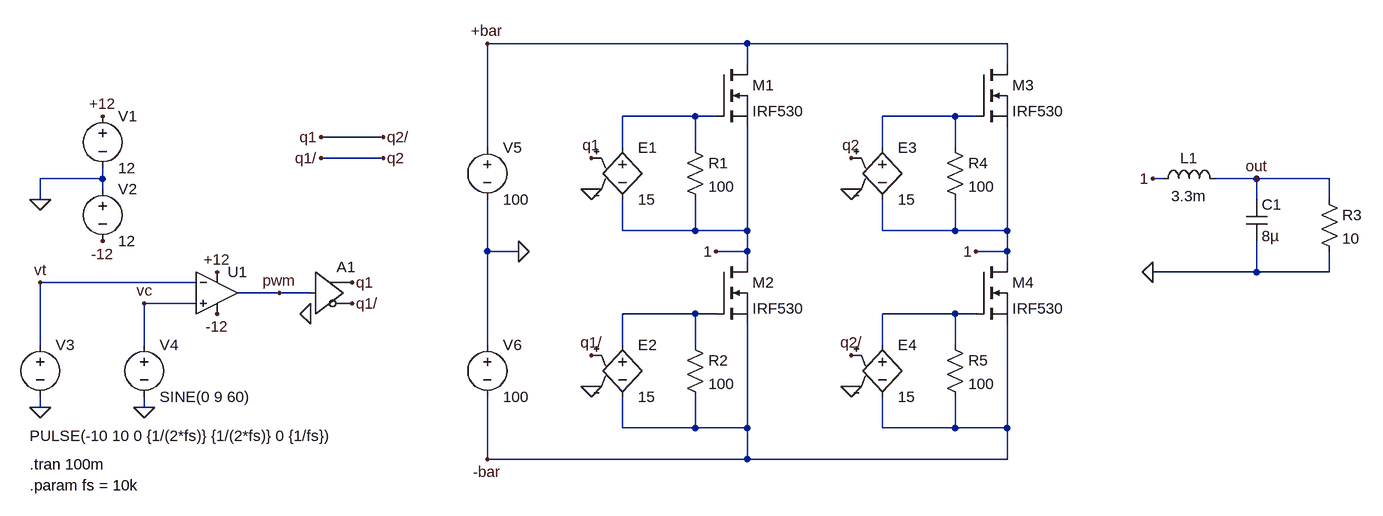
[diagram p0: schematic EXP07_1.asc]
EXP07_1.asc, the LTspice schematic file:
Version 4
SHEET 1 2024 680
WIRE 1072 -112 672 -112
WIRE 1472 -112 1072 -112
WIRE 1072 -80 1072 -112
WIRE 1472 -80 1472 -112
WIRE 992 0 880 0
WIRE 1024 0 992 0
WIRE 1392 0 1280 0
WIRE 1424 0 1392 0
WIRE 512 32 416 32
WIRE 672 48 672 -112
WIRE 880 48 880 0
WIRE 992 48 992 0
WIRE 1280 48 1280 0
WIRE 1392 48 1392 0
WIRE 512 64 416 64
WIRE 80 96 80 80
WIRE 80 96 -16 96
WIRE 1712 96 1696 96
WIRE 1856 96 1792 96
WIRE 1968 96 1856 96
WIRE 80 112 80 96
WIRE -16 128 -16 96
WIRE 1856 128 1856 96
WIRE 1968 128 1968 96
WIRE 880 176 880 128
WIRE 992 176 992 128
WIRE 992 176 880 176
WIRE 1072 176 1072 16
WIRE 1072 176 992 176
WIRE 1280 176 1280 128
WIRE 1392 176 1392 128
WIRE 1392 176 1280 176
WIRE 1472 176 1472 16
WIRE 1472 176 1392 176
WIRE 672 208 672 128
WIRE 720 208 672 208
WIRE 1072 208 1072 176
WIRE 1072 208 1024 208
WIRE 1472 208 1472 176
WIRE 1472 208 1424 208
WIRE 1072 224 1072 208
WIRE 1472 224 1472 208
WIRE 1856 240 1856 192
WIRE 1856 240 1696 240
WIRE 1968 240 1968 208
WIRE 1968 240 1856 240
WIRE 224 256 -16 256
WIRE 352 272 288 272
WIRE 400 272 352 272
WIRE 224 288 144 288
WIRE 992 304 880 304
WIRE 1024 304 992 304
WIRE 1392 304 1280 304
WIRE 1424 304 1392 304
WIRE -16 352 -16 256
WIRE 144 352 144 288
WIRE 672 352 672 208
WIRE 880 352 880 304
WIRE 992 352 992 304
WIRE 1280 352 1280 304
WIRE 1392 352 1392 304
WIRE -16 448 -16 432
WIRE 144 448 144 432
WIRE 880 480 880 432
WIRE 992 480 992 432
WIRE 992 480 880 480
WIRE 1072 480 1072 320
WIRE 1072 480 992 480
WIRE 1280 480 1280 432
WIRE 1392 480 1392 432
WIRE 1392 480 1280 480
WIRE 1472 480 1472 320
WIRE 1472 480 1392 480
WIRE 672 528 672 432
WIRE 1072 528 1072 480
WIRE 1072 528 672 528
WIRE 1472 528 1472 480
WIRE 1472 528 1072 528
FLAG -16 128 0
FLAG -16 448 0
FLAG 144 448 0
FLAG 400 304 0
FLAG 80 0 +12
FLAG 256 240 +12
FLAG 80 192 -12
FLAG 256 304 -12
FLAG 464 256 q1
FLAG 464 288 q1/
FLAG -16 256 vt
FLAG 144 288 vc
FLAG 832 112 0
FLAG 832 416 0
FLAG 1696 240 0
FLAG 720 208 0
FLAG 832 64 q1
FLAG 832 368 q1/
FLAG 1696 96 1
FLAG 1024 208 1
FLAG 672 -112 +bar
FLAG 672 528 -bar
FLAG 1856 96 out
FLAG 352 272 pwm
FLAG 416 32 q1
FLAG 512 32 q2/
FLAG 416 64 q1/
FLAG 512 64 q2
FLAG 1232 112 0
FLAG 1232 416 0
FLAG 1424 208 1
FLAG 1232 64 q2
FLAG 1232 368 q2/
SYMBOL voltage 80 -16 R0
WINDOW 123 0 0 Left 0
WINDOW 39 0 0 Left 0
SYMATTR InstName V1
SYMATTR Value 12
SYMBOL voltage 80 96 R0
WINDOW 123 0 0 Left 0
WINDOW 39 0 0 Left 0
SYMATTR InstName V2
SYMATTR Value 12
SYMBOL voltage -16 336 R0
WINDOW 3 -16 156 Left 2
WINDOW 123 0 0 Left 0
WINDOW 39 0 0 Left 0
SYMATTR InstName V3
SYMATTR Value PULSE(-10 10 0 {1/(2*fs)} {1/(2*fs)} 0 {1/fs})
SYMBOL voltage 144 336 R0
WINDOW 123 0 0 Left 0
WINDOW 39 0 0 Left 0
SYMATTR InstName V4
SYMATTR Value SINE(0 9 60)
SYMBOL voltage 672 32 R0
WINDOW 123 0 0 Left 0
WINDOW 39 0 0 Left 0
SYMATTR InstName V5
SYMATTR Value 100
SYMBOL OpAmps\\UniversalOpAmp2 256 272 R0
SYMATTR InstName U1
SYMBOL Digital\\buf 400 208 R0
SYMATTR InstName A1
SYMBOL e 880 32 R0
SYMATTR InstName E1
SYMATTR Value 15
SYMBOL nmos 1024 -80 R0
SYMATTR InstName M1
SYMATTR Value IRF530
SYMBOL res 976 32 R0
SYMATTR InstName R1
SYMATTR Value 100
SYMBOL voltage 672 336 R0
WINDOW 123 0 0 Left 0
WINDOW 39 0 0 Left 0
SYMATTR InstName V6
SYMATTR Value 100
SYMBOL e 880 336 R0
SYMATTR InstName E2
SYMATTR Value 15
SYMBOL nmos 1024 224 R0
SYMATTR InstName M2
SYMATTR Value IRF530
SYMBOL res 976 336 R0
SYMATTR InstName R2
SYMATTR Value 100
SYMBOL ind 1696 112 R270
WINDOW 0 32 56 VTop 2
WINDOW 3 5 56 VBottom 2
SYMATTR InstName L1
SYMATTR Value 3.3m
SYMBOL cap 1840 128 R0
SYMATTR InstName C1
SYMATTR Value 8µ
SYMATTR SpiceLine Rser=0.01
SYMBOL res 1952 112 R0
SYMATTR InstName R3
SYMATTR Value 10
SYMBOL e 1280 32 R0
SYMATTR InstName E3
SYMATTR Value 15
SYMBOL nmos 1424 -80 R0
SYMATTR InstName M3
SYMATTR Value IRF530
SYMBOL res 1376 32 R0
SYMATTR InstName R4
SYMATTR Value 100
SYMBOL e 1280 336 R0
SYMATTR InstName E4
SYMATTR Value 15
SYMBOL nmos 1424 224 R0
SYMATTR InstName M4
SYMATTR Value IRF530
SYMBOL res 1376 336 R0
SYMATTR InstName R5
SYMATTR Value 100
TEXT -32 536 Left 2 !.tran 100m
TEXT -32 568 Left 2 !.param fs = 10k

The netlist it stands for:
* EXP07_1.asc
V1 +12 0 12
V2 0 -12 12
V3 vt 0 PULSE(-10 10 0 {1/(2*fs)} {1/(2*fs)} 0 {1/fs})
V4 vc 0 SINE(0 9 60)
V5 +bar 0 100
XU1 vc vt +12 -12 pwm level2 Avol=1Meg GBW=10Meg Slew=10Meg Ilimit=25m Rail=0 Vos=0 En=0 Enk=0 In=0 Ink=0 Rin=500Meg  ; pins In+ In- V+ V- OUT
A1 pwm 0 0 0 0 q2 q2/ 0 BUF
E1 N001 1 q2/ 0 15
M1 +bar N001 1 1 IRF530
R1 N001 1 100
V6 0 -bar 100
E2 N003 -bar q2 0 15
M2 1 N003 -bar -bar IRF530
R2 N003 -bar 100
L1 1 out 3.3m
C1 out 0 8µ Rser=0.01
R3 out 0 10
E3 N002 1 q2 0 15
M3 +bar N002 1 1 IRF530
R4 N002 1 100
E4 N004 -bar q2/ 0 15
M4 1 N004 -bar -bar IRF530
R5 N004 -bar 100
.model NMOS NMOS
.model PMOS PMOS
.lib standard.mos
.tran 100m
.param fs = 10k
.lib UniversalOpAmp2.lib
.backanno
.end